# EAGLE design shield (EAGLE 9.0.1)
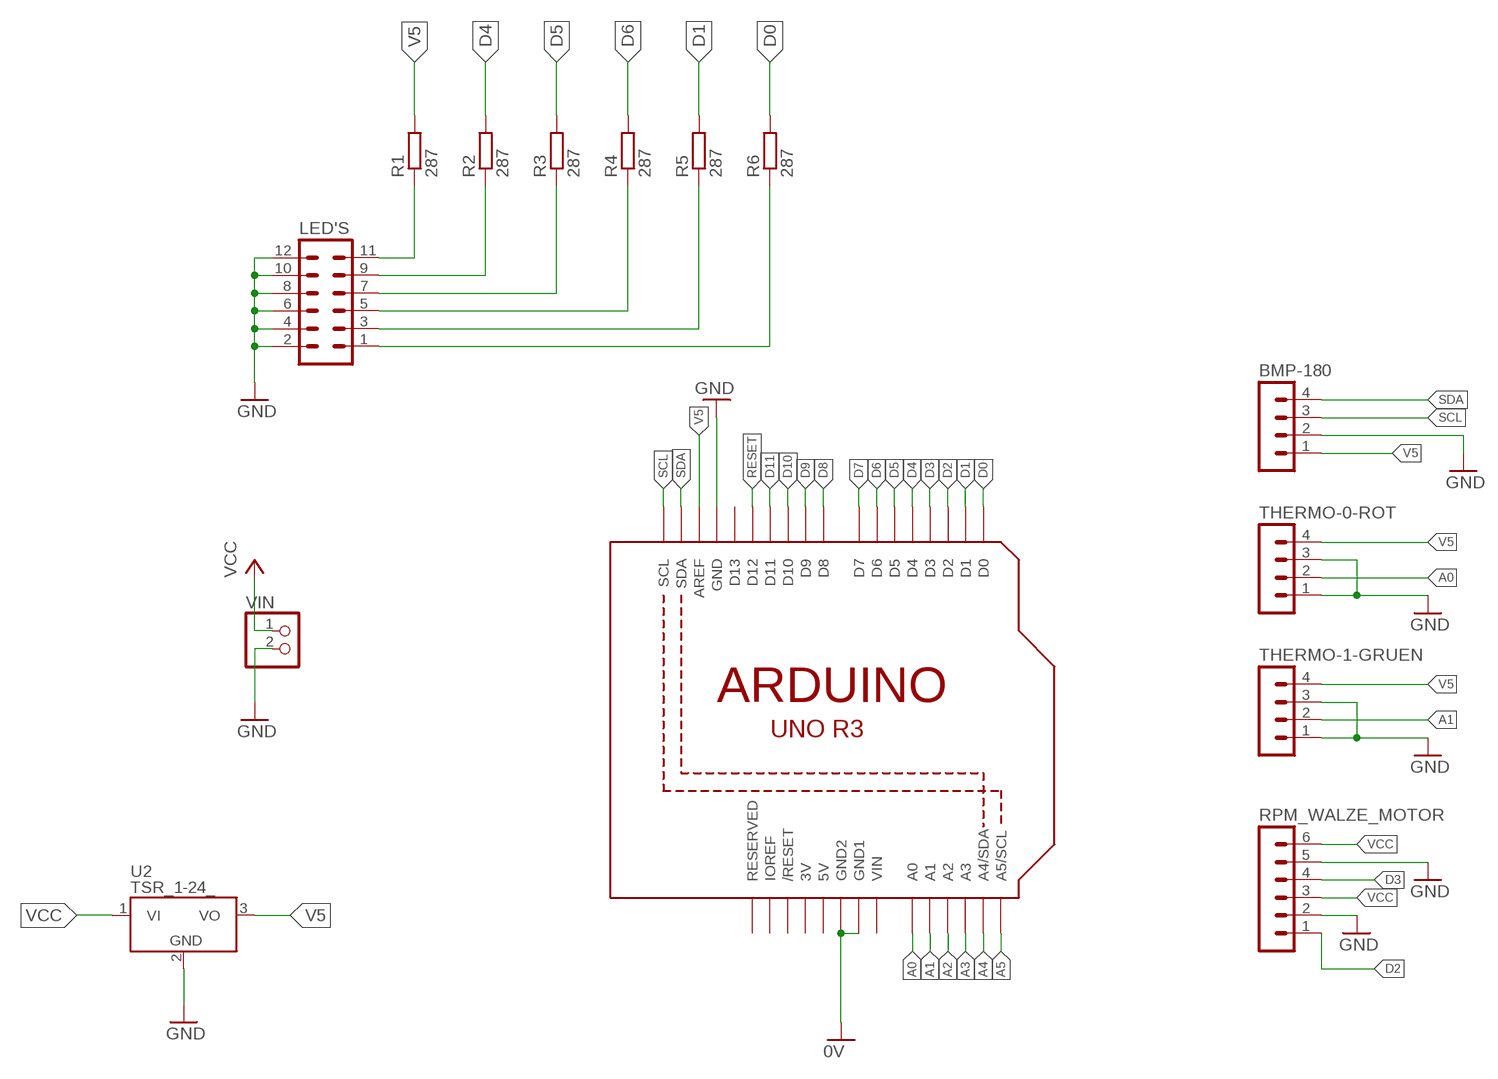
[diagram p0: schematic, sheet 1]

## Parts
BMP-180  MA04-1  [MA04-1]
LED'S  MA06-2  [MA06-2]
R1  287  R-EU_0207/10  [0207/10]
R2  287  R-EU_0207/10  [0207/10]
R3  287  R-EU_0207/10  [0207/10]
R4  287  R-EU_0207/10  [0207/10]
R5  287  R-EU_0207/10  [0207/10]
R6  287  R-EU_0207/10  [0207/10]
RPM_WALZE_MOTOR  MA06-1  [MA06-1]
THERMO-0-ROT  MA04-1  [MA04-1]
THERMO-1-GRUEN  MA04-1  [MA04-1]
U1  ARDUINOR3-BPLACE  [ARDUINOR3-BPLACE]
U2  TSR_1-24_  [TSR-1]
VIN  PINHD-1X2  [1X02]

## Nets
A0: THERMO-0-ROT.2 U1.A0
A1: THERMO-1-GRUEN.2 U1.A1
A2: U1.A2
A3: U1.A3
A4: U1.A4(A4/SDA)
A5: U1.A5(A5/SCL)
D0: R6.2 U1.D0
D1: R5.2 U1.D1
D2: RPM_WALZE_MOTOR.1 U1.D2
D3: RPM_WALZE_MOTOR.4 U1.D3
D4: R2.2 U1.D4
D5: R3.2 U1.D5
D6: R4.2 U1.D6
D7: U1.D7
D8: U1.D8
D9: U1.D9
D10: U1.D10
D11: U1.D11
GND: BMP-180.2 LED'S.2 LED'S.4 LED'S.6 LED'S.8 LED'S.10 LED'S.12 RPM_WALZE_MOTOR.2 RPM_WALZE_MOTOR.5 THERMO-0-ROT.1 THERMO-0-ROT.3 THERMO-1-GRUEN.1 THERMO-1-GRUEN.3 U1.GND U1.GND1 U1.GND2 U2.2(GND) VIN.2 ; supply symbol labelled 0V
N$1: LED'S.9 R2.1
N$2: LED'S.7 R3.1
N$3: LED'S.5 R4.1
N$4: LED'S.3 R5.1
N$5: LED'S.1 R6.1
N$6: LED'S.11 R1.1
RESET: U1.D12
SCL: BMP-180.3 U1.SCL
SDA: BMP-180.4 U1.SDA
V5: BMP-180.1 R1.2 THERMO-0-ROT.4 THERMO-1-GRUEN.4 U1.AREF U2.3(VO)
VCC: RPM_WALZE_MOTOR.3 RPM_WALZE_MOTOR.6 U2.1(VI) VIN.1
Unconnected: U1.D13 U1.IOREF U1.RESERVED U1.RESET(/RESET)

## Power pins joined to a net without a drawn wire
3V: U1.3V
5V: U1.5V
VIN: U1.VIN

## Library data of the parts
BMP-180 THERMO-0-ROT THERMO-1-GRUEN = con-lstb:MA04-1: PIN HEADER; OC_FARNELL: unknown; OC_NEWARK: unknown
LED'S = con-lstb:MA06-2: PIN HEADER; OC_FARNELL: unknown; OC_NEWARK: unknown
R1-R6 = rcl:R-EU_: RESISTOR, European symbol; SPICEPREFIX: R
RPM_WALZE_MOTOR = con-lstb:MA06-1: PIN HEADER; OC_FARNELL: unknown; OC_NEWARK: unknown
U1 = adafruit:ARDUINOR3: This is a new object for the new Arduino R3 - with extra pins that you may want to use (such as IOref, and duplicated A4/A5
U2 = _traco_tsr-1:TSR_1-*: TRACO TSR-1 Series Point-of-Load DC/DC-Converters Vi max. 36 V; Vo = (1.2 .. 15)V ±2%; Io = 0 .. 1 A SIP-Package (drop-in replacement for 78xx linear voltage regulators in TO220-package, vertically assembled) Source: www.tracopower.com Technologies: TSR 1- Vi (V) Vo (V) ±2% Io = 0 .. 1 A 24_ ( generic ) 2412 4.6 .. 36 1.2 2415 4.6 .. 36 1.5 2418 4.6 .. 36 1.8 2425 4.6 .. 36 2.5 2433 4.75.. 36 3.3 2450 6.5 .. 36 5.0 2465 9.0 .. 36 6.5 2490 12 .. 36 9.0 24120 15 .. 36 12 24150 18 .. 36 15 Author: Dipl.-Ing. FH Rainer Bayer HHN Hochschule Heilbronn, rainer.bayer@hs-heilbronn.de Ingenieurbüro ing-rb, mail@ing-rb.de
VIN = pinhead:PINHD-1X2: PIN HEADER

## Board
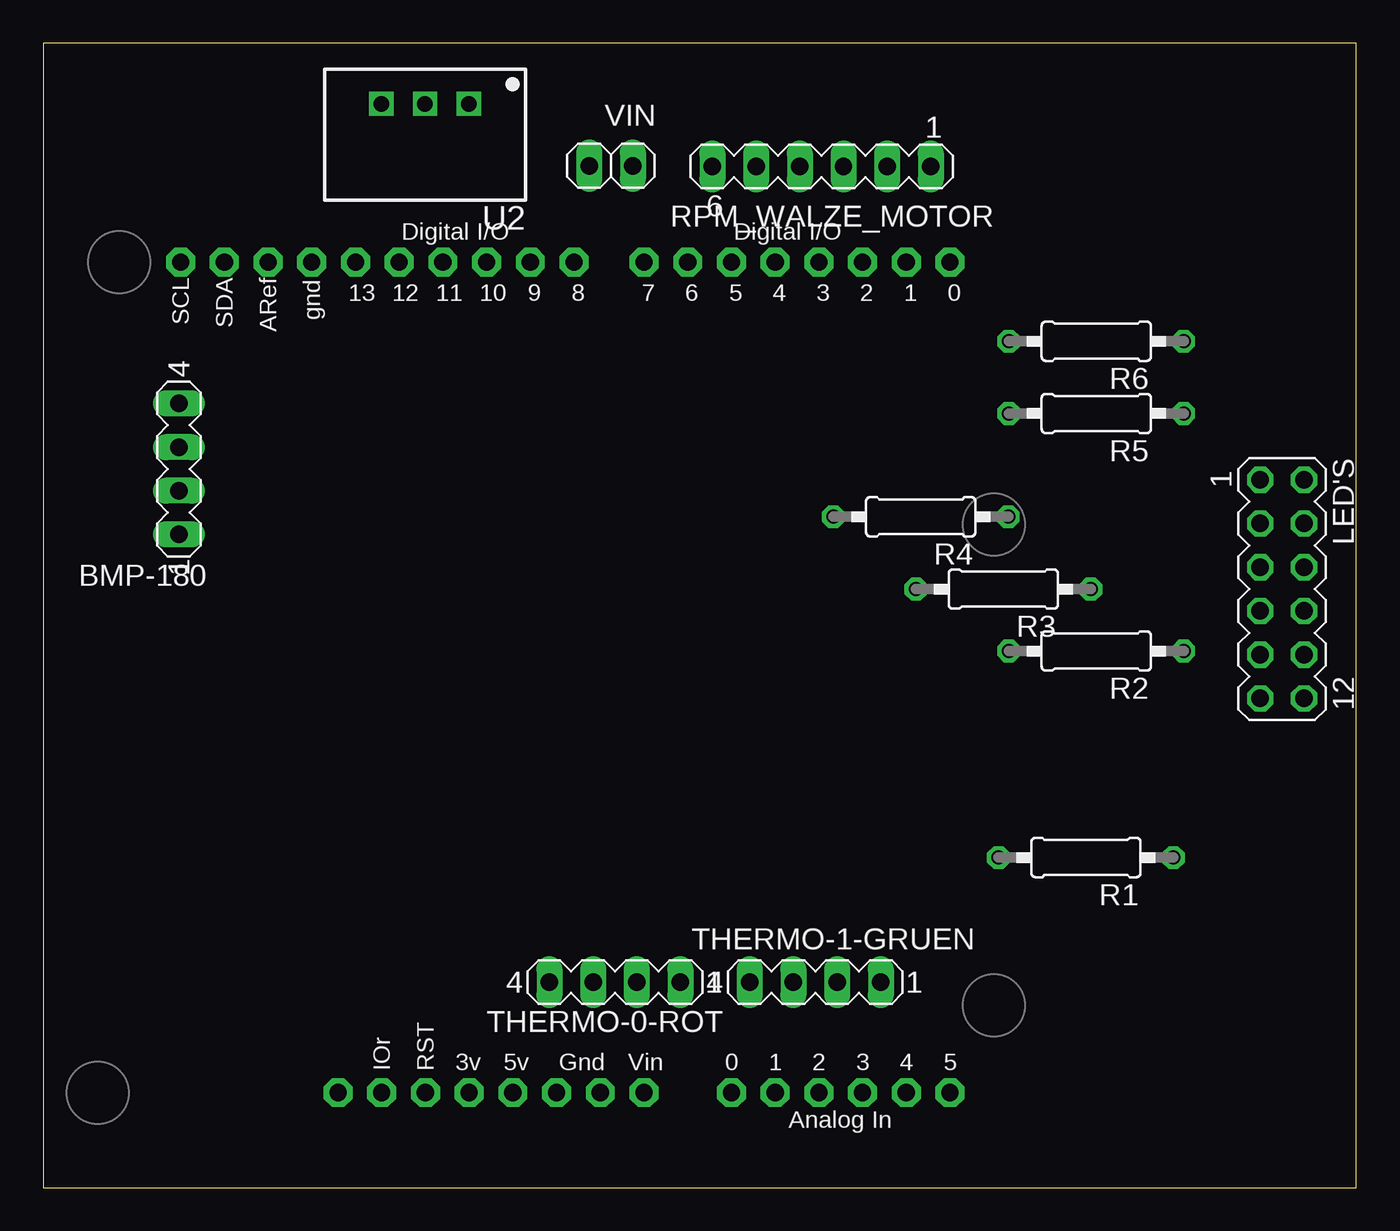
[diagram p1: board, top side]
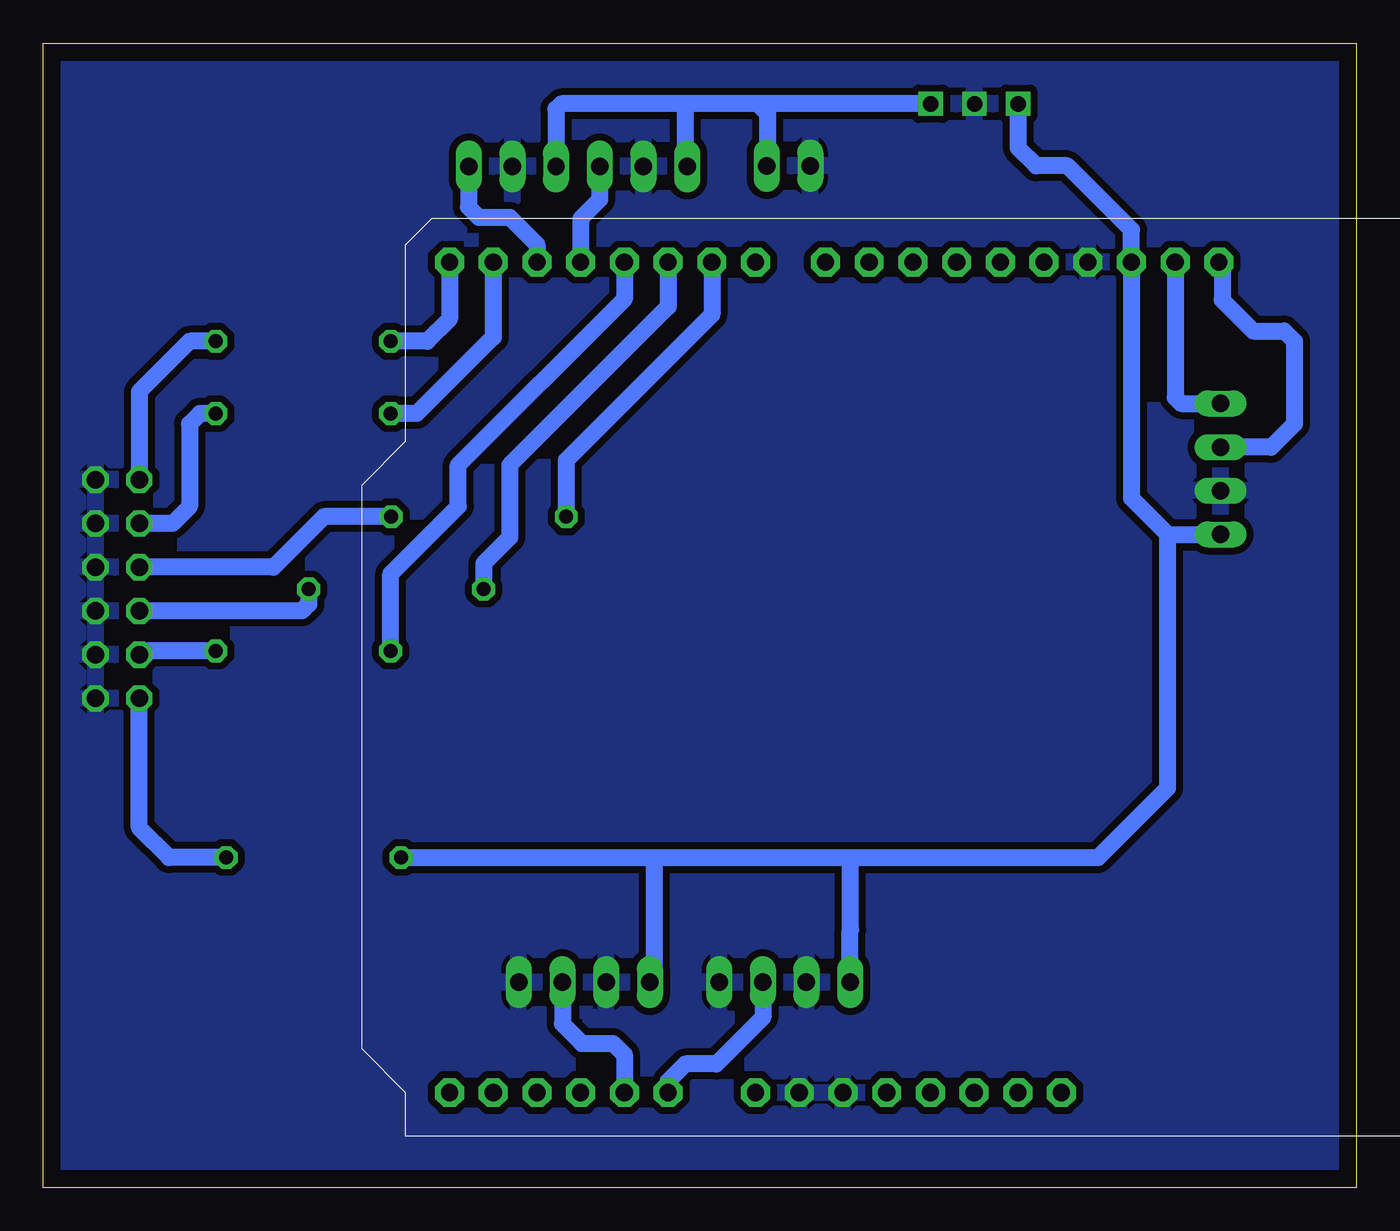
[diagram p2: board, bottom side, seen from below]

Size 76.32 x 66.53 mm. Coordinates in mm from the lower left corner, seen from the top.
Outline: 0,0 76.32,0 76.32,66.53 0,66.53 0,0
Copper layers (1*16): Top 0.035mm / dielectric 1.5mm / Bottom 0.035mm
Design rules "default": minimum track width 6mil, minimum drill 0.35mm, track to track 6mil, track to pad 6mil, pad to pad 6mil, via to via 6mil, smd to smd 6mil, copper to edge 40mil, drill to drill 6mil, minimum pad ring 10mil, minimum via ring 8mil, stop-mask expansion 4mil, vias tented up to drill 0mil, thermal gap 10mil

### Footprints (pad centres in the part's own frame; a part is rotated, then mirrored left to right if it is on the bottom)
MA04-1 = drill 1.016 long: 1 -3.81,0; 2 -1.27,0; 3 1.27,0; 4 3.81,0
MA06-2 = drill 1.016 octagon: 1 -6.35,-1.27; 2 -6.35,1.27; 3 -3.81,-1.27; 4 -3.81,1.27; 5 -1.27,-1.27; 6 -1.27,1.27; 7 1.27,-1.27; 8 1.27,1.27; 9 3.81,-1.27; 10 3.81,1.27; 11 6.35,-1.27; 12 6.35,1.27
0207/10 = drill 0.813 octagon: 1 -5.08,0; 2 5.08,0
MA06-1 = drill 1.016 long: 1 -6.35,0; 2 -3.81,0; 3 -1.27,0; 4 1.27,0; 5 3.81,0; 6 6.35,0
ARDUINOR3-BPLACE = drill 1 pad 1.676 octagon: 3V 35.56,2.54; 5V 38.1,2.54; A0 50.8,2.54; A1 53.34,2.54; A2 55.88,2.54; A3 58.42,2.54; A4 60.96,2.54; A5 63.5,2.54; AREF 23.876,50.8; D0 63.5,50.8; D1 60.96,50.8; D2 58.42,50.8; D3 55.88,50.8; D4 53.34,50.8; D5 50.8,50.8; D6 48.26,50.8; D7 45.72,50.8; D8 41.656,50.8; D9 39.116,50.8; D10 36.576,50.8; D11 34.036,50.8; D12 31.496,50.8; D13 28.956,50.8; GND 26.416,50.8; GND1 43.18,2.54; GND2 40.64,2.54; IOREF 30.48,2.54; RESERVED 27.94,2.54; RESET 33.02,2.54; SCL 18.796,50.8; SDA 21.336,50.8; VIN 45.72,2.54
TSR-1 = drill 0.9 square: 1 -2.54,0; 2 0,0; 3 2.54,0
1X02 = drill 1.016 long: 1 -1.27,0; 2 1.27,0

### Placement (x,y rotation side)
BMP-180  7.89,41.78 90 top
LED'S  72,34.8 270 top
R1  60.6,19.2 180 top
R2  61.2,31.2 180 top
R3  55.8,34.8 180 top
R4  51,39 180 top
R5  61.2,45 180 top
R6  61.2,49.2 180 top
RPM_WALZE_MOTOR  45.24,59.36 180 top
THERMO-0-ROT  33.23,11.96 180 top
THERMO-1-GRUEN  44.87,11.96 180 top
U1  -10.8,3 0 top
U2  22.2,63 180 top
VIN  33,59.4 180 top

### Tracks (layer width: path | path; a pad name or v marks a point on that pad's centre or on a via)
A0
  Bottom 1: THERMO-0-ROT.2 34.5,9.9 37.2,7.2 39,7.2 40,6.2 U1.A0
A1
  Bottom 1: THERMO-1-GRUEN.2 46.14,9.54 45,8.4 43.2,8.4 42.54,7.74 U1.A1
D0
  Bottom 1: U1.D0 52.7,50.5 54,49.2 R6.2
D1
  Bottom 1: U1.D1 50.16,49.44 54.6,45 R5.2
D2
  Bottom 1: RPM_WALZE_MOTOR.1 51.59,57.01 51.6,57 51,56.4 49.2,56.4 47.62,54.82 U1.D2
D3
  Bottom 1: RPM_WALZE_MOTOR.4 43.97,57.43 45.08,56.32 U1.D3
D4
  Bottom 1: U1.D4 42.54,51.66 52.2,42 52.2,39.6 56.12,35.68 R2.2
D5
  Bottom 1: U1.D5 40,51.2 49.2,42 49.2,37.8 50.72,36.28 R3.2
D6
  Bottom 1: U1.D6 37.46,50.74 45.92,42.28 R4.2
GND
  pour Bottom (isolate 0.406): 0,0 75.6,0 76.2,0.6 76.2,65.4 75.6,66 0.6,66 0.6,0.6
N$1
  Bottom 1: R2.1 70.52,31.2 LED'S.9
N$2
  Bottom 1: R3.1 60.88,33.92 61.27,33.53 LED'S.7
N$3
  Bottom 1: R4.1 60,39 62.93,36.07 LED'S.5
N$4
  Bottom 1: R5.1 67.2,45 67.8,44.4 67.8,39.6 68.79,38.61 LED'S.3
N$5
  Bottom 1: R6.1 67.8,49.2 70.73,46.27 LED'S.1
N$6
  Bottom 1: R1.1 69,19.2 70.73,20.93 LED'S.11
SCL
  Bottom 1: U1.SCL 7.8,53.6 7.8,51.6 6,49.8 4.2,49.8 3.6,49.2 3.6,44.4 4.95,43.05 BMP-180.3
SDA
  Bottom 1: U1.SDA 10.54,45.94 10.19,45.59 BMP-180.4
V5
  Bottom 1: U2.3 19.66,60.46 18.6,59.4 16.8,59.4 13.08,55.68 U1.AREF 13.08,40.08 10.97,37.97 | 10.97,37.97 BMP-180.1 | 10.97,37.97 10.97,23.23 15,19.2 29.4,19.2 | THERMO-0-ROT.4 29.42,14.98 29.4,15 29.4,19.2 | THERMO-1-GRUEN.4 40.8,12.22 40.8,19.2 | R1.2 40.8,19.2 | 40.8,19.2 29.4,19.2
VCC
  Bottom 1: VIN.1 34.2,59.47 34.2,62.4 34.8,63 | RPM_WALZE_MOTOR.3 46.51,62.69 46.2,63 39,63 | U2.1 34.8,63 | 34.8,63 39,63 | RPM_WALZE_MOTOR.6 39,59.47 39,63